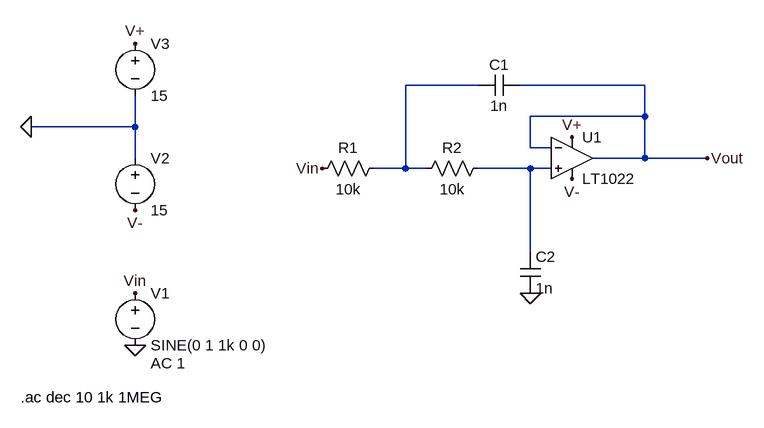
[diagram p0: schematic 5.asc]
5.asc, the LTspice schematic file:
Version 4
SHEET 1 1144 680
WIRE 480 -160 368 -160
WIRE 736 -160 544 -160
WIRE 736 -112 736 -160
WIRE 736 -112 560 -112
WIRE -48 -96 -48 -144
WIRE -48 -96 -208 -96
WIRE 560 -64 560 -112
WIRE 592 -64 560 -64
WIRE -48 -48 -48 -96
WIRE 736 -48 736 -112
WIRE 736 -48 656 -48
WIRE 832 -48 736 -48
WIRE 368 -32 368 -160
WIRE 368 -32 320 -32
WIRE 400 -32 368 -32
WIRE 560 -32 480 -32
WIRE 592 -32 560 -32
WIRE 560 96 560 -32
FLAG -208 -96 0
FLAG -48 240 0
FLAG 560 160 0
FLAG -48 160 Vin
FLAG 240 -32 Vin
FLAG -48 -224 V+
FLAG -48 32 V-
FLAG 624 -16 V-
FLAG 624 -80 V+
FLAG 832 -48 Vout
SYMBOL cap 544 -176 R90
WINDOW 0 0 32 VBottom 2
WINDOW 3 32 32 VTop 2
SYMATTR InstName C1
SYMATTR Value 1n
SYMBOL cap 544 96 R0
SYMATTR InstName C2
SYMATTR Value 1n
SYMBOL OpAmps\\LT1022 624 -112 R0
SYMATTR InstName U1
SYMBOL res 336 -48 R90
WINDOW 0 0 56 VBottom 2
WINDOW 3 32 56 VTop 2
SYMATTR InstName R1
SYMATTR Value 10k
SYMBOL res 496 -48 R90
WINDOW 0 0 56 VBottom 2
WINDOW 3 32 56 VTop 2
SYMATTR InstName R2
SYMATTR Value 10k
SYMBOL voltage -48 144 R0
WINDOW 123 24 124 Left 2
WINDOW 39 0 0 Left 0
SYMATTR Value2 AC 1
SYMATTR InstName V1
SYMATTR Value SINE(0 1 1k 0 0)
SYMBOL voltage -48 -64 R0
WINDOW 123 0 0 Left 0
WINDOW 39 0 0 Left 0
SYMATTR InstName V2
SYMATTR Value 15
SYMBOL voltage -48 -240 R0
WINDOW 123 0 0 Left 0
WINDOW 39 0 0 Left 0
SYMATTR InstName V3
SYMATTR Value 15
TEXT -224 320 Left 2 !.ac dec 10 1k 1MEG

The netlist it stands for:
* 5.asc
C1 Vout N001 1n
C2 N002 0 1n
XU1 N002 Vout V+ V- Vout LT1022  ; pins In+ In- V+ V- OUT
R1 N001 Vin 10k
R2 N002 N001 10k
V1 Vin 0 SINE(0 1 1k 0 0) AC 1
V2 0 V- 15
V3 V+ 0 15
.ac dec 10 1k 1MEG
.backanno
.end